# EAGLE design untitled (EAGLE 9.6.1)
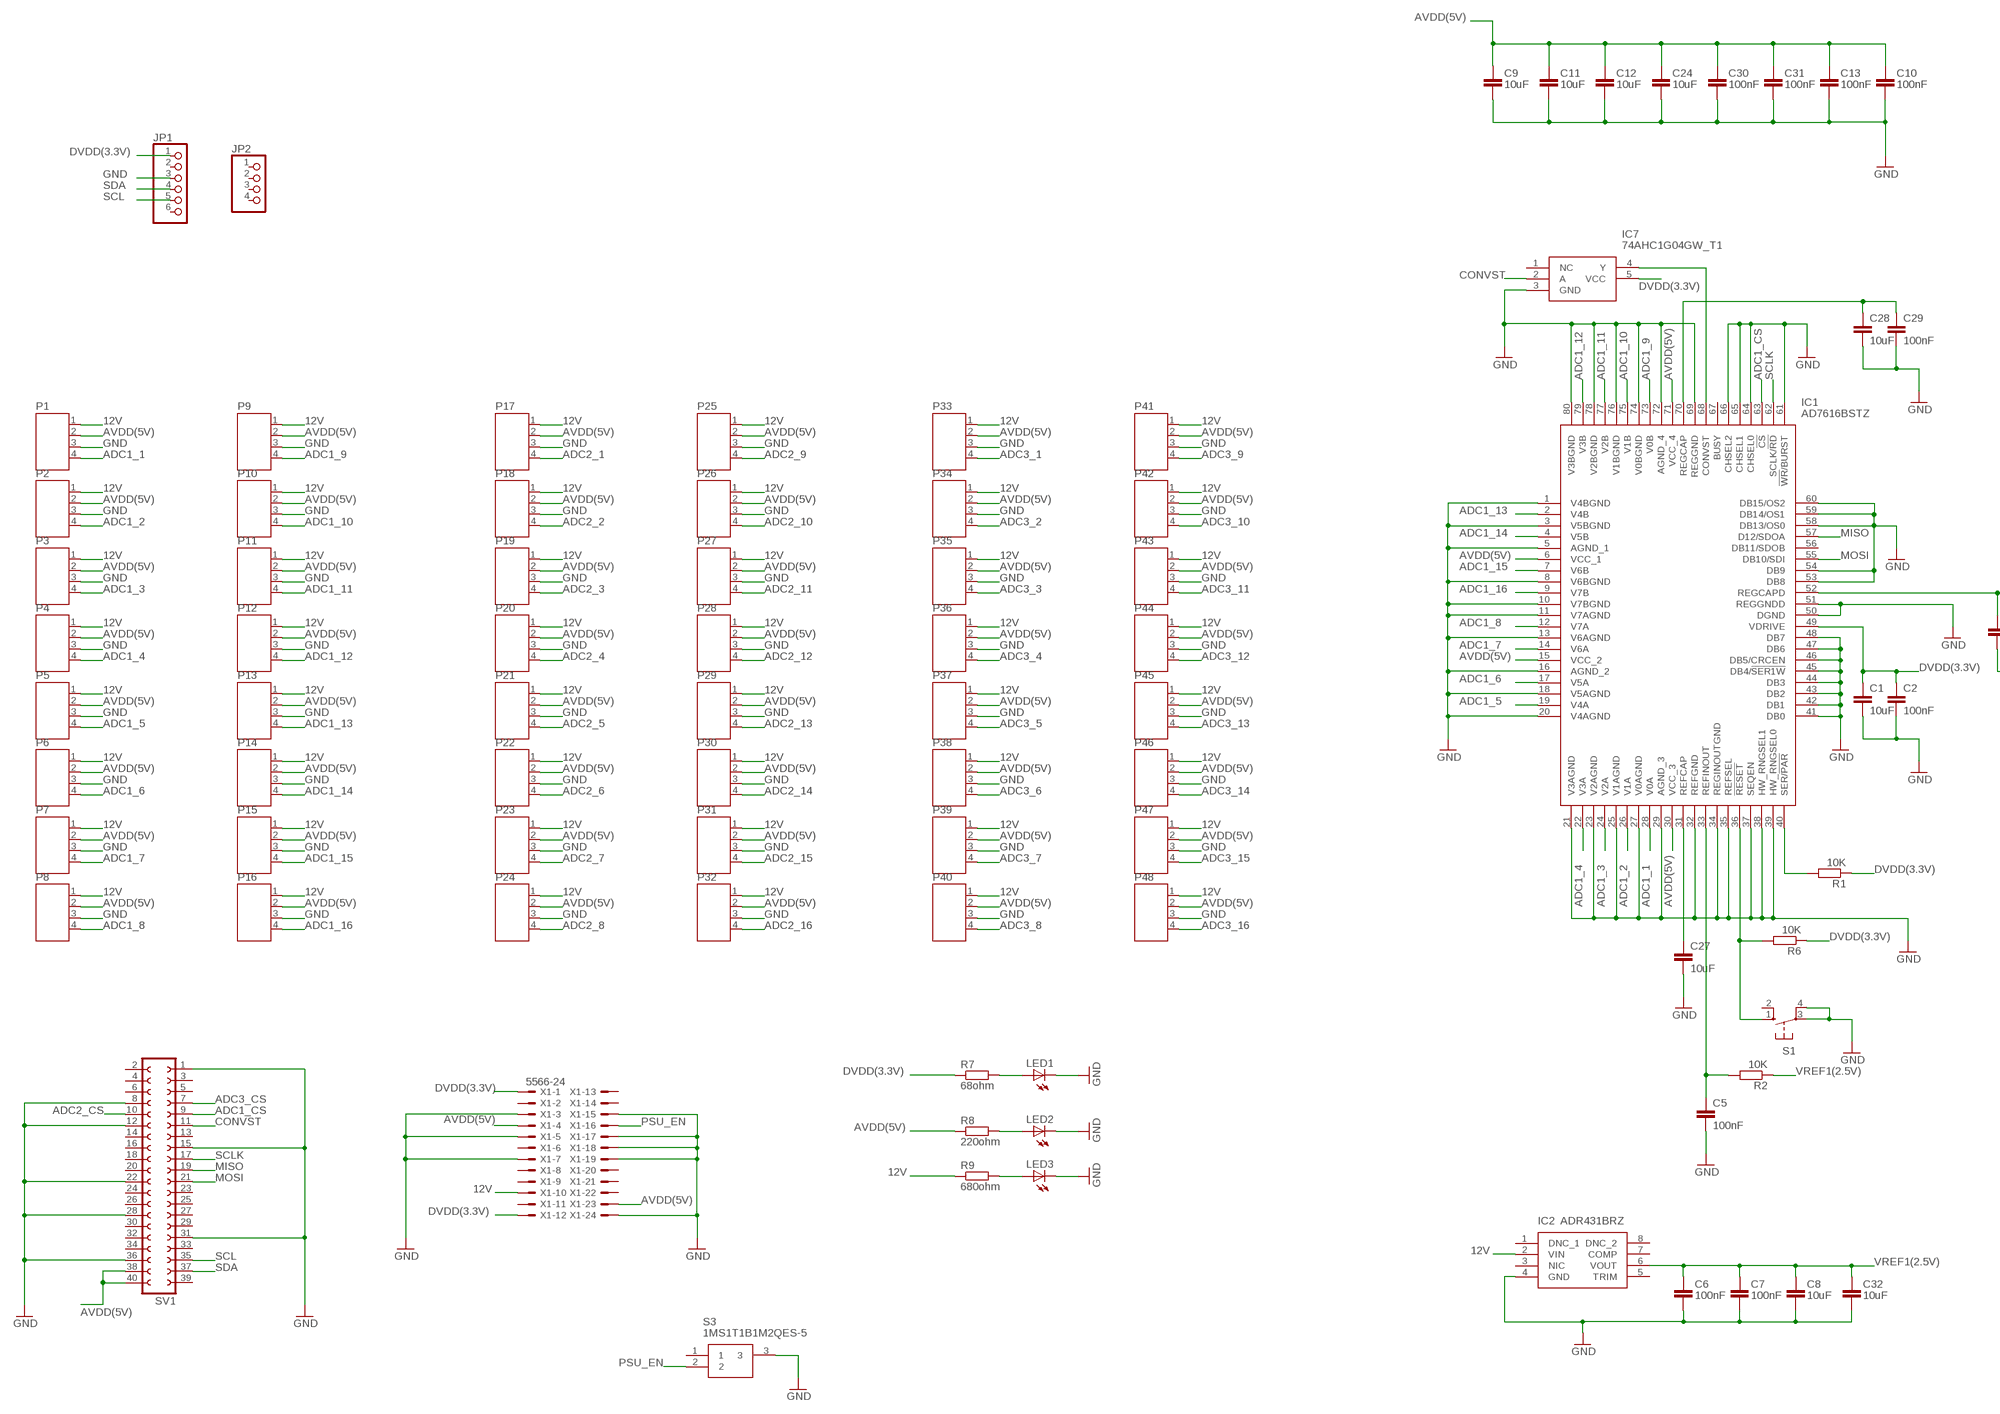
[diagram p0: schematic, sheet 1, part 1 of 2]
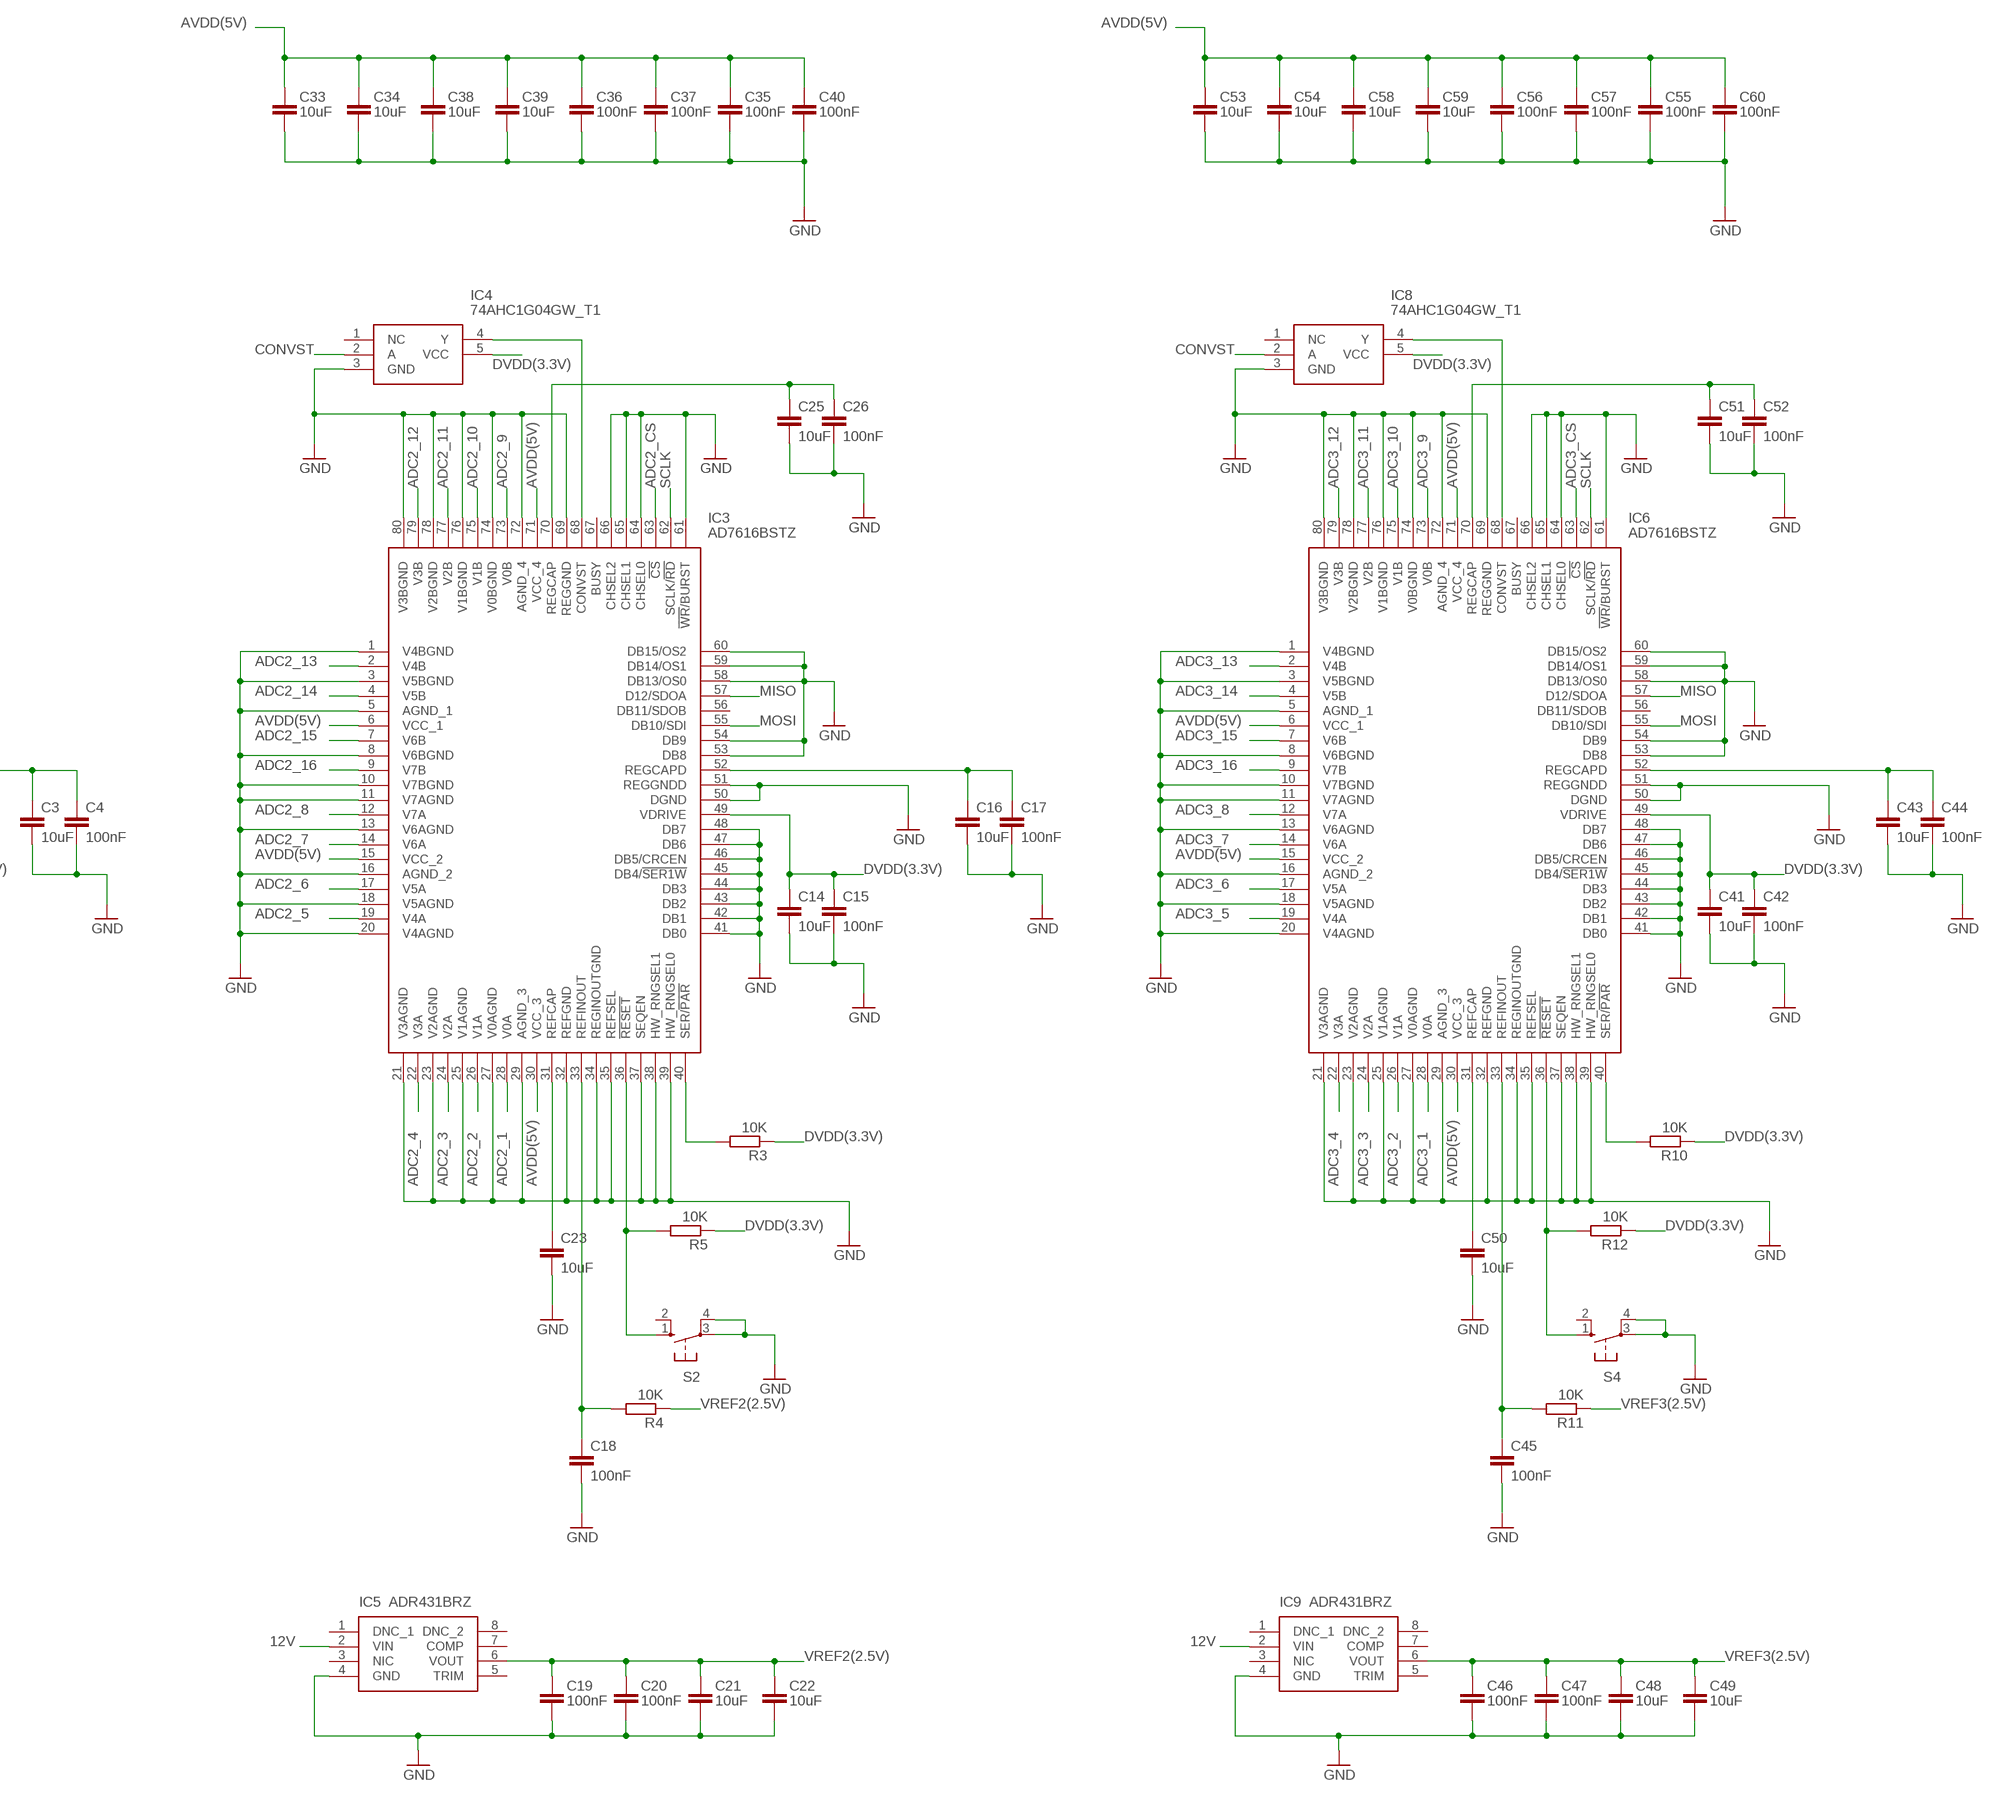
[diagram p1: schematic, sheet 1, part 2 of 2]

## Parts
C1  10uF  C-EUC1206  [C1206]
C2  100nF  C-EUC0603  [C0603]
C3  10uF  C-EUC1206  [C1206]
C4  100nF  C-EUC0603  [C0603]
C5  100nF  C-EUC0603  [C0603]
C6  100nF  C-EUC0603  [C0603]
C7  100nF  C-EUC0603  [C0603]
C8  10uF  C-EUC1206  [C1206]
C9  10uF  C-EUC1206  [C1206]
C10  100nF  C-EUC0603  [C0603]
C11  10uF  C-EUC1206  [C1206]
C12  10uF  C-EUC1206  [C1206]
C13  100nF  C-EUC0603  [C0603]
C14  10uF  C-EUC1206  [C1206]
C15  100nF  C-EUC0603  [C0603]
C16  10uF  C-EUC1206  [C1206]
C17  100nF  C-EUC0603  [C0603]
C18  100nF  C-EUC0603  [C0603]
C19  100nF  C-EUC0603  [C0603]
C20  100nF  C-EUC0603  [C0603]
C21  10uF  C-EUC1206  [C1206]
C22  10uF  C-EUC1206  [C1206]
C23  10uF  C-EUC1206  [C1206]
C24  10uF  C-EUC1206  [C1206]
C25  10uF  C-EUC1206  [C1206]
C26  100nF  C-EUC0603  [C0603]
C27  10uF  C-EUC1206  [C1206]
C28  10uF  C-EUC1206  [C1206]
C29  100nF  C-EUC0603  [C0603]
C30  100nF  C-EUC0603  [C0603]
C31  100nF  C-EUC0603  [C0603]
C32  10uF  C-EUC1206  [C1206]
C33  10uF  C-EUC1206  [C1206]
C34  10uF  C-EUC1206  [C1206]
C35  100nF  C-EUC0603  [C0603]
C36  100nF  C-EUC0603  [C0603]
C37  100nF  C-EUC0603  [C0603]
C38  10uF  C-EUC1206  [C1206]
C39  10uF  C-EUC1206  [C1206]
C40  100nF  C-EUC0603  [C0603]
C41  10uF  C-EUC1206  [C1206]
C42  100nF  C-EUC0603  [C0603]
C43  10uF  C-EUC1206  [C1206]
C44  100nF  C-EUC0603  [C0603]
C45  100nF  C-EUC0603  [C0603]
C46  100nF  C-EUC0603  [C0603]
C47  100nF  C-EUC0603  [C0603]
C48  10uF  C-EUC1206  [C1206]
C49  10uF  C-EUC1206  [C1206]
C50  10uF  C-EUC1206  [C1206]
C51  10uF  C-EUC1206  [C1206]
C52  100nF  C-EUC0603  [C0603]
C53  10uF  C-EUC1206  [C1206]
C54  10uF  C-EUC1206  [C1206]
C55  100nF  C-EUC0603  [C0603]
C56  100nF  C-EUC0603  [C0603]
C57  100nF  C-EUC0603  [C0603]
C58  10uF  C-EUC1206  [C1206]
C59  10uF  C-EUC1206  [C1206]
C60  100nF  C-EUC0603  [C0603]
IC1  AD7616BSTZ  [QFP65P1600X1600X160-80N]
IC2  ADR431BRZ  [SOIC127P600X175-8N]
IC3  AD7616BSTZ  [QFP65P1600X1600X160-80N]
IC4  74AHC1G04GW_T1  [SOT65P212X110-5N]
IC5  ADR431BRZ  [SOIC127P600X175-8N]
IC6  AD7616BSTZ  [QFP65P1600X1600X160-80N]
IC7  74AHC1G04GW_T1  [SOT65P212X110-5N]
IC8  74AHC1G04GW_T1  [SOT65P212X110-5N]
IC9  ADR431BRZ  [SOIC127P600X175-8N]
JP1  PINHD-1X6  [1X06]
JP2  PINHD-1X4  [1X04]
LED1  LEDCHIPLED_0603  [CHIPLED_0603]
LED2  LEDCHIPLED_0603  [CHIPLED_0603]
LED3  LEDCHIPLED_0603  [CHIPLED_0603]
P1  JST-PH4  [JST-PH4]
P2  JST-PH4  [JST-PH4]
P3  JST-PH4  [JST-PH4]
P4  JST-PH4  [JST-PH4]
P5  JST-PH4  [JST-PH4]
P6  JST-PH4  [JST-PH4]
P7  JST-PH4  [JST-PH4]
P8  JST-PH4  [JST-PH4]
P9  JST-PH4  [JST-PH4]
P10  JST-PH4  [JST-PH4]
P11  JST-PH4  [JST-PH4]
P12  JST-PH4  [JST-PH4]
P13  JST-PH4  [JST-PH4]
P14  JST-PH4  [JST-PH4]
P15  JST-PH4  [JST-PH4]
P16  JST-PH4  [JST-PH4]
P17  JST-PH4  [JST-PH4]
P18  JST-PH4  [JST-PH4]
P19  JST-PH4  [JST-PH4]
P20  JST-PH4  [JST-PH4]
P21  JST-PH4  [JST-PH4]
P22  JST-PH4  [JST-PH4]
P23  JST-PH4  [JST-PH4]
P24  JST-PH4  [JST-PH4]
P25  JST-PH4  [JST-PH4]
P26  JST-PH4  [JST-PH4]
P27  JST-PH4  [JST-PH4]
P28  JST-PH4  [JST-PH4]
P29  JST-PH4  [JST-PH4]
P30  JST-PH4  [JST-PH4]
P31  JST-PH4  [JST-PH4]
P32  JST-PH4  [JST-PH4]
P33  JST-PH4  [JST-PH4]
P34  JST-PH4  [JST-PH4]
P35  JST-PH4  [JST-PH4]
P36  JST-PH4  [JST-PH4]
P37  JST-PH4  [JST-PH4]
P38  JST-PH4  [JST-PH4]
P39  JST-PH4  [JST-PH4]
P40  JST-PH4  [JST-PH4]
P41  JST-PH4  [JST-PH4]
P42  JST-PH4  [JST-PH4]
P43  JST-PH4  [JST-PH4]
P44  JST-PH4  [JST-PH4]
P45  JST-PH4  [JST-PH4]
P46  JST-PH4  [JST-PH4]
P47  JST-PH4  [JST-PH4]
P48  JST-PH4  [JST-PH4]
R1  10K  R-EU_R0603  [R0603]
R2  10K  R-EU_R0603  [R0603]
R3  10K  R-EU_R0603  [R0603]
R4  10K  R-EU_R0603  [R0603]
R5  10K  R-EU_R0603  [R0603]
R6  10K  R-EU_R0603  [R0603]
R7  68ohm  R-EU_R0805  [R0805]
R8  220ohm  R-EU_R0805  [R0805]
R9  680ohm  R-EU_R0805  [R0805]
R10  10K  R-EU_R0603  [R0603]
R11  10K  R-EU_R0603  [R0603]
R12  10K  R-EU_R0603  [R0603]
S1  10-XX  [B3F-10XX]
S2  10-XX  [B3F-10XX]
S3  1MS1T1B1M2QES-5  [1MS1T1B1M2QES-5]
S4  10-XX  [B3F-10XX]
SV1  FE20-2  [FE20-2]
X1  5566-24  [5566-24]

## Nets
12V: IC2.2(VIN) IC5.2(VIN) IC9.2(VIN) P1.1 P2.1 P3.1 P4.1 P5.1 P6.1 P7.1 P8.1 P9.1 P10.1 P11.1 P12.1 P13.1 P14.1 P15.1 P16.1 P17.1 P18.1 P19.1 P20.1 P21.1 P22.1 P23.1 P24.1 P25.1 P26.1 P27.1 P28.1 P29.1 P30.1 P31.1 P32.1 P33.1 P34.1 P35.1 P36.1 P37.1 P38.1 P39.1 P40.1 P41.1 P42.1 P43.1 P44.1 P45.1 P46.1 P47.1 P48.1 R9.1 X1.10
!RESET1: IC1.36(!RESET) R6.2 S1.1(S)
!RESET2: IC3.36(!RESET) R5.2 S2.1(S)
!RESET3: IC6.36(!RESET) R12.2 S4.1(S)
ADC1_1: IC1.28(V0A) P1.4
ADC1_2: IC1.26(V1A) P2.4
ADC1_3: IC1.24(V2A) P3.4
ADC1_4: IC1.22(V3A) P4.4
ADC1_5: IC1.19(V4A) P5.4
ADC1_6: IC1.17(V5A) P6.4
ADC1_7: IC1.14(V6A) P7.4
ADC1_8: IC1.12(V7A) P8.4
ADC1_9: IC1.73(V0B) P9.4
ADC1_10: IC1.75(V1B) P10.4
ADC1_11: IC1.77(V2B) P11.4
ADC1_12: IC1.79(V3B) P12.4
ADC1_13: IC1.2(V4B) P13.4
ADC1_14: IC1.4(V5B) P14.4
ADC1_15: IC1.7(V6B) P15.4
ADC1_16: IC1.9(V7B) P16.4
ADC1_CS: IC1.63(!CS) SV1.9
ADC2_1: IC3.28(V0A) P17.4
ADC2_2: IC3.26(V1A) P18.4
ADC2_3: IC3.24(V2A) P19.4
ADC2_4: IC3.22(V3A) P20.4
ADC2_5: IC3.19(V4A) P21.4
ADC2_6: IC3.17(V5A) P22.4
ADC2_7: IC3.14(V6A) P23.4
ADC2_8: IC3.12(V7A) P24.4
ADC2_9: IC3.73(V0B) P25.4
ADC2_10: IC3.75(V1B) P26.4
ADC2_11: IC3.77(V2B) P27.4
ADC2_12: IC3.79(V3B) P28.4
ADC2_13: IC3.2(V4B) P29.4
ADC2_14: IC3.4(V5B) P30.4
ADC2_15: IC3.7(V6B) P31.4
ADC2_16: IC3.9(V7B) P32.4
ADC2_CS: IC3.63(!CS) SV1.10
ADC3_1: IC6.28(V0A) P33.4
ADC3_2: IC6.26(V1A) P34.4
ADC3_3: IC6.24(V2A) P35.4
ADC3_4: IC6.22(V3A) P36.4
ADC3_5: IC6.19(V4A) P37.4
ADC3_6: IC6.17(V5A) P38.4
ADC3_7: IC6.14(V6A) P39.4
ADC3_8: IC6.12(V7A) P40.4
ADC3_9: IC6.73(V0B) P41.4
ADC3_10: IC6.75(V1B) P42.4
ADC3_11: IC6.77(V2B) P43.4
ADC3_12: IC6.79(V3B) P44.4
ADC3_13: IC6.2(V4B) P45.4
ADC3_14: IC6.4(V5B) P46.4
ADC3_15: IC6.7(V6B) P47.4
ADC3_16: IC6.9(V7B) P48.4
ADC3_CS: IC6.63(!CS) SV1.7
AVDD(5V): C9.1 C10.1 C11.1 C12.1 C13.1 C24.1 C30.1 C31.1 C33.1 C34.1 C35.1 C36.1 C37.1 C38.1 C39.1 C40.1 C53.1 C54.1 C55.1 C56.1 C57.1 C58.1 C59.1 C60.1 IC1.6(VCC_1) IC1.15(VCC_2) IC1.30(VCC_3) IC1.71(VCC_4) IC3.6(VCC_1) IC3.15(VCC_2) IC3.30(VCC_3) IC3.71(VCC_4) IC6.6(VCC_1) IC6.15(VCC_2) IC6.30(VCC_3) IC6.71(VCC_4) P1.2 P2.2 P3.2 P4.2 P5.2 P6.2 P7.2 P8.2 P9.2 P10.2 P11.2 P12.2 P13.2 P14.2 P15.2 P16.2 P17.2 P18.2 P19.2 P20.2 P21.2 P22.2 P23.2 P24.2 P25.2 P26.2 P27.2 P28.2 P29.2 P30.2 P31.2 P32.2 P33.2 P34.2 P35.2 P36.2 P37.2 P38.2 P39.2 P40.2 P41.2 P42.2 P43.2 P44.2 P45.2 P46.2 P47.2 P48.2 R8.1 SV1.38 SV1.40 X1.4 X1.23
CONVST: IC4.2(A) IC7.2(A) IC8.2(A) SV1.11
CONVST1: IC1.68(CONVST) IC7.4(Y)
CONVST2: IC3.68(CONVST) IC4.4(Y)
CONVST3: IC6.68(CONVST) IC8.4(Y)
DVDD(3.3V): C1.1 C2.1 C14.1 C15.1 C41.1 C42.1 IC1.49(VDRIVE) IC3.49(VDRIVE) IC4.5(VCC) IC6.49(VDRIVE) IC7.5(VCC) IC8.5(VCC) JP1.1 R1.1 R3.1 R5.1 R6.1 R7.1 R10.1 R12.1 X1.1 X1.12
GND: C1.2 C2.2 C3.2 C4.2 C5.2 C6.2 C7.2 C8.2 C9.2 C10.2 C11.2 C12.2 C13.2 C14.2 C15.2 C16.2 C17.2 C18.2 C19.2 C20.2 C21.2 C22.2 C23.2 C24.2 C25.2 C26.2 C27.2 C28.2 C29.2 C30.2 C31.2 C32.2 C33.2 C34.2 C35.2 C36.2 C37.2 C38.2 C39.2 C40.2 C41.2 C42.2 C43.2 C44.2 C45.2 C46.2 C47.2 C48.2 C49.2 C50.2 C51.2 C52.2 C53.2 C54.2 C55.2 C56.2 C57.2 C58.2 C59.2 C60.2 IC1.1(V4BGND) IC1.3(V5BGND) IC1.5(AGND_1) IC1.8(V6BGND) IC1.10(V7BGND) IC1.11(V7AGND) IC1.13(V6AGND) IC1.16(AGND_2) IC1.18(V5AGND) IC1.20(V4AGND) IC1.21(V3AGND) IC1.23(V2AGND) IC1.25(V1AGND) IC1.27(V0AGND) IC1.29(AGND_3) IC1.32(REFGND) IC1.34(REGINOUTGND) IC1.35(REFSEL) IC1.37(SEQEN) IC1.38(HW_RNGSEL1) IC1.39(HW_RNGSEL0) IC1.41(DB0) IC1.42(DB1) IC1.43(DB2) IC1.44(DB3) IC1.45(DB4/!SER1W) IC1.46(DB5/CRCEN) IC1.47(DB6) IC1.48(DB7) IC1.50(DGND) IC1.51(REGGNDD) IC1.53(DB8) IC1.54(DB9) IC1.58(DB13/OS0) IC1.59(DB14/OS1) IC1.60(DB15/OS2) IC1.61(!WR!/BURST) IC1.64(CHSEL0) IC1.65(CHSEL1) IC1.66(CHSEL2) IC1.69(REGGND) IC1.72(AGND_4) IC1.74(V0BGND) IC1.76(V1BGND) IC1.78(V2BGND) IC1.80(V3BGND) IC2.4(GND) IC3.1(V4BGND) IC3.3(V5BGND) IC3.5(AGND_1) IC3.8(V6BGND) IC3.10(V7BGND) IC3.11(V7AGND) IC3.13(V6AGND) IC3.16(AGND_2) IC3.18(V5AGND) IC3.20(V4AGND) IC3.21(V3AGND) IC3.23(V2AGND) IC3.25(V1AGND) IC3.27(V0AGND) IC3.29(AGND_3) IC3.32(REFGND) IC3.34(REGINOUTGND) IC3.35(REFSEL) IC3.37(SEQEN) IC3.38(HW_RNGSEL1) IC3.39(HW_RNGSEL0) IC3.41(DB0) IC3.42(DB1) IC3.43(DB2) IC3.44(DB3) IC3.45(DB4/!SER1W) IC3.46(DB5/CRCEN) IC3.47(DB6) IC3.48(DB7) IC3.50(DGND) IC3.51(REGGNDD) IC3.53(DB8) IC3.54(DB9) IC3.58(DB13/OS0) IC3.59(DB14/OS1) IC3.60(DB15/OS2) IC3.61(!WR!/BURST) IC3.64(CHSEL0) IC3.65(CHSEL1) IC3.66(CHSEL2) IC3.69(REGGND) IC3.72(AGND_4) IC3.74(V0BGND) IC3.76(V1BGND) IC3.78(V2BGND) IC3.80(V3BGND) IC4.3(GND) IC5.4(GND) IC6.1(V4BGND) IC6.3(V5BGND) IC6.5(AGND_1) IC6.8(V6BGND) IC6.10(V7BGND) IC6.11(V7AGND) IC6.13(V6AGND) IC6.16(AGND_2) IC6.18(V5AGND) IC6.20(V4AGND) IC6.21(V3AGND) IC6.23(V2AGND) IC6.25(V1AGND) IC6.27(V0AGND) IC6.29(AGND_3) IC6.32(REFGND) IC6.34(REGINOUTGND) IC6.35(REFSEL) IC6.37(SEQEN) IC6.38(HW_RNGSEL1) IC6.39(HW_RNGSEL0) IC6.41(DB0) IC6.42(DB1) IC6.43(DB2) IC6.44(DB3) IC6.45(DB4/!SER1W) IC6.46(DB5/CRCEN) IC6.47(DB6) IC6.48(DB7) IC6.50(DGND) IC6.51(REGGNDD) IC6.53(DB8) IC6.54(DB9) IC6.58(DB13/OS0) IC6.59(DB14/OS1) IC6.60(DB15/OS2) IC6.61(!WR!/BURST) IC6.64(CHSEL0) IC6.65(CHSEL1) IC6.66(CHSEL2) IC6.69(REGGND) IC6.72(AGND_4) IC6.74(V0BGND) IC6.76(V1BGND) IC6.78(V2BGND) IC6.80(V3BGND) IC7.3(GND) IC8.3(GND) IC9.4(GND) JP1.3 LED1.C LED2.C LED3.C P1.3 P2.3 P3.3 P4.3 P5.3 P6.3 P7.3 P8.3 P9.3 P10.3 P11.3 P12.3 P13.3 P14.3 P15.3 P16.3 P17.3 P18.3 P19.3 P20.3 P21.3 P22.3 P23.3 P24.3 P25.3 P26.3 P27.3 P28.3 P29.3 P30.3 P31.3 P32.3 P33.3 P34.3 P35.3 P36.3 P37.3 P38.3 P39.3 P40.3 P41.3 P42.3 P43.3 P44.3 P45.3 P46.3 P47.3 P48.3 S1.3(P) S1.4(P1) S2.3(P) S2.4(P1) S3.3 S4.3(P) S4.4(P1) SV1.1 SV1.8 SV1.12 SV1.15 SV1.22 SV1.28 SV1.31 SV1.36 X1.3 X1.5 X1.7 X1.15 X1.17 X1.18 X1.19 X1.24
MISO: IC1.57(D12/SDOA) IC3.57(D12/SDOA) IC6.57(D12/SDOA) SV1.19
MOSI: IC1.55(DB10/SDI) IC3.55(DB10/SDI) IC6.55(DB10/SDI) SV1.21
N$1: LED2.A R8.2
N$3: LED1.A R7.2
N$4: LED3.A R9.2
PSU_EN: S3.2 X1.16
REFCAP1: C27.1 IC1.31(REFCAP)
REFCAP2: C23.1 IC3.31(REFCAP)
REFCAP3: C50.1 IC6.31(REFCAP)
REFINOUT1: C5.1 IC1.33(REFINOUT) R2.2
REFINOUT2: C18.1 IC3.33(REFINOUT) R4.2
REFINOUT3: C45.1 IC6.33(REFINOUT) R11.2
REGCAP1: C28.1 C29.1 IC1.70(REGCAP)
REGCAP2: C25.1 C26.1 IC3.70(REGCAP)
REGCAP3: C51.1 C52.1 IC6.70(REGCAP)
REGCAPD1: C3.1 C4.1 IC1.52(REGCAPD)
REGCAPD2: C16.1 C17.1 IC3.52(REGCAPD)
REGCAPD3: C43.1 C44.1 IC6.52(REGCAPD)
SCL: JP1.5 SV1.35
SCLK: IC1.62(SCLK/!RD) IC3.62(SCLK/!RD) IC6.62(SCLK/!RD) SV1.17
SDA: JP1.4 SV1.37
SER/!PAR1: IC1.40(SER/!PAR) R1.2
SER/!PAR2: IC3.40(SER/!PAR) R3.2
SER/!PAR3: IC6.40(SER/!PAR) R10.2
VREF1(2.5V): C6.1 C7.1 C8.1 C32.1 IC2.6(VOUT) R2.1
VREF2(2.5V): C19.1 C20.1 C21.1 C22.1 IC5.6(VOUT) R4.1
VREF3(2.5V): C46.1 C47.1 C48.1 C49.1 IC9.6(VOUT) R11.1
Unconnected: IC1.56(DB11/SDOB) IC1.67(BUSY) IC2.1(DNC_1) IC2.3(NIC) IC2.5(TRIM) IC2.7(COMP) IC2.8(DNC_2) IC3.56(DB11/SDOB) IC3.67(BUSY) IC4.1(NC) IC5.1(DNC_1) IC5.3(NIC) IC5.5(TRIM) IC5.7(COMP) IC5.8(DNC_2) IC6.56(DB11/SDOB) IC6.67(BUSY) IC7.1(NC) IC8.1(NC) IC9.1(DNC_1) IC9.3(NIC) IC9.5(TRIM) IC9.7(COMP) IC9.8(DNC_2) JP1.2 JP1.6 JP2.1 JP2.2 JP2.3 JP2.4 S1.2(S1) S2.2(S1) S3.1 S4.2(S1) SV1.2 SV1.3 SV1.4 SV1.5 SV1.6 SV1.13 SV1.14 SV1.16 SV1.18 SV1.20 SV1.23 SV1.24 SV1.25 SV1.26 SV1.27 SV1.29 SV1.30 SV1.32 SV1.33 SV1.34 SV1.39 X1.2 X1.6 X1.8 X1.9 X1.11 X1.13 X1.14 X1.20 X1.21 X1.22

## Library data of the parts
C1-C60 = rcl:C-EU: CAPACITOR, European symbol; SPICEPREFIX: C
IC1 IC3 IC6 = AD7616BSTZ:AD7616BSTZ: Data Acquisition ADCs/DACs - Specialized 100ksps 16 ch muxed Dual 16B SAR ADC Source: Datasheet <https://componentsearchengine.com/Datasheets/1/AD7616BSTZ.pdf>; DESCRIPTION: Data Acquisition ADCs/DACs - Specialized 100ksps 16 ch muxed Dual 16B SAR ADC; HEIGHT: 1.6mm; MANUFACTURER_NAME: Analog Devices; MANUFACTURER_PART_NUMBER: AD7616BSTZ; MOUSER_PART_NUMBER: 584-AD7616BSTZ; MOUSER_PRICE-STOCK: https://www.mouser.com/Search/Refine.aspx?Keyword=584-AD7616BSTZ; RS_PART_NUMBER: 1311218P; RS_PRICE-STOCK: http://uk.rs-online.com/web/p/products/1311218P
IC2 IC5 IC9 = ADR431BRZ:ADR431BRZ: ADR431BRZ, Precision Voltage Reference 2.499 to 2.501V, 0.04% 30mA 20V max. 8-Pin SOIC Source: Datasheet <http://www.analog.com/static/imported-files/data_sheets/ADR430_431_433_434_435.pdf>; DESCRIPTION: ADR431BRZ, Precision Voltage Reference 2.499 to 2.501V, 0.04% 30mA 20V max. 8-Pin SOIC; HEIGHT: 1.75mm; MANUFACTURER_NAME: Analog Devices; MANUFACTURER_PART_NUMBER: ADR431BRZ; MOUSER_PART_NUMBER: 584-ADR431BRZ; MOUSER_PRICE-STOCK: https://www.mouser.com/Search/Refine.aspx?Keyword=584-ADR431BRZ; RS_PART_NUMBER: 6977745P; RS_PRICE-STOCK: http://uk.rs-online.com/web/p/products/6977745P
IC4 IC7 IC8 = 74AHC1G04GW_T1:74AHC1G04GW_T1: NXP - 74AHC1G04GW - INVERTER, 74AHC SINGLE GATE, SOT-353 Source: Datasheet <http://www.nxp.com/documents/data_sheet/74AHC_AHCT1G04.pdf>; DESCRIPTION: NXP - 74AHC1G04GW - INVERTER, 74AHC SINGLE GATE, SOT-353; HEIGHT: 1.1mm; MANUFACTURER_NAME: Nexperia; MANUFACTURER_PART_NUMBER: 74AHC1G04GW/T1
JP1 = pinhead:PINHD-1X6: PIN HEADER
JP2 = pinhead:PINHD-1X4: PIN HEADER
LED1-LED3 = adafruit:LED: LED OSRAM: - CHIPLED LG R971, LG N971, LY N971, LG Q971, LY Q971, LO R971, LY R971 LH N974, LH R974 LS Q976, LO Q976, LY Q976 LO Q996 - Hyper CHIPLED LW Q18S LB Q993, LB Q99A, LB R99A - SideLED LS A670, LO A670, LY A670, LG A670, LP A670 LB A673, LV A673, LT A673, LW A673 LH A674 LY A675 LS A676, LA A676, LO A676, LY A676, LW A676 LS A679, LY A679, LG A679 - Hyper Micro SIDELED® LS Y876, LA Y876, LO Y876, LY Y876 LT Y87S - SmartLED LW L88C, LW L88S LB L89C, LB L89S, LG L890 LS L89K, LO L89K, LY L89K LS L896, LA L896, LO L896, LY L896 - TOPLED LS T670, LO T670, LY T670, LG T670, LP T670 LSG T670, LSP T670, LSY T670, LOP T670, LYG T670 LG T671, LOG T671, LSG T671 LB T673, LV T673, LT T673, LW T673 LH T674 LS T676, LA T676, LO T676, LY T676, LB T676, LH T676, LSB T676, LW T676 LB T67C, LV T67C, LT T67C, LS T67K, LO T67K, LY T67K, LW E67C LS E67B, LA E67B, LO E67B, LY E67B, LB E67C, LV E67C, LT E67C LW T67C LS T679, LY T679, LG T679 LS T770, LO T770, LY T770, LG T770, LP T770 LB T773, LV T773, LT T773, LW T773 LH T774 LS E675, LA E675, LY E675, LS T675 LS T776, LA T776, LO T776, LY T776, LB T776 LHGB T686 LT T68C, LB T68C - Hyper Mini TOPLED® LB M676 - Mini TOPLED Santana® LG M470 LS M47K, LO M47K, LY M47K Source: http://www.osram.convergy.de/
P1-P48 = jst-ph:JST-PH4
R1-R12 = rcl:R-EU_: RESISTOR, European symbol; SPICEPREFIX: R
S1 S2 S4 = switch-omron:10-XX: OMRON SWITCH; MPN: B3F-1000; OC_FARNELL: 176432; OC_NEWARK: 36M3542
S3 = 1MS1T1B1M2QES-5:1MS1T1B1M2QES-5: Toggle switch,SP,on-none-on,PC thru-hole Toggle Switch SPDT On-On, 5 A @ 250 V ac, PCB Source: Datasheet <http://uk.rs-online.com/web/p/products/7347066>; DESCRIPTION: Toggle switch,SP,on-none-on,PC thru-hole Toggle Switch SPDT On-On, 5 A @ 250 V ac, PCB; HEIGHT: mm; MANUFACTURER_NAME: RS Components; MANUFACTURER_PART_NUMBER: 1MS1T1B1M2QES-5; RS_PART_NUMBER: 7347066; RS_PRICE-STOCK: https://uk.rs-online.com/web/p/products/7347066
SV1 = con-lsta:FE20-2: FEMALE HEADER; OC_FARNELL: unknown; OC_NEWARK: unknown
X1 = con-molex:5566-24: Mini FIT connector 24 pol Source: http://www.molex.com; MF: MOLEX; OC_FARNELL: unknown; OC_NEWARK: unknown

## Net classes
0 default: width 0.254 mm, clearance 0.178 mm

## Board
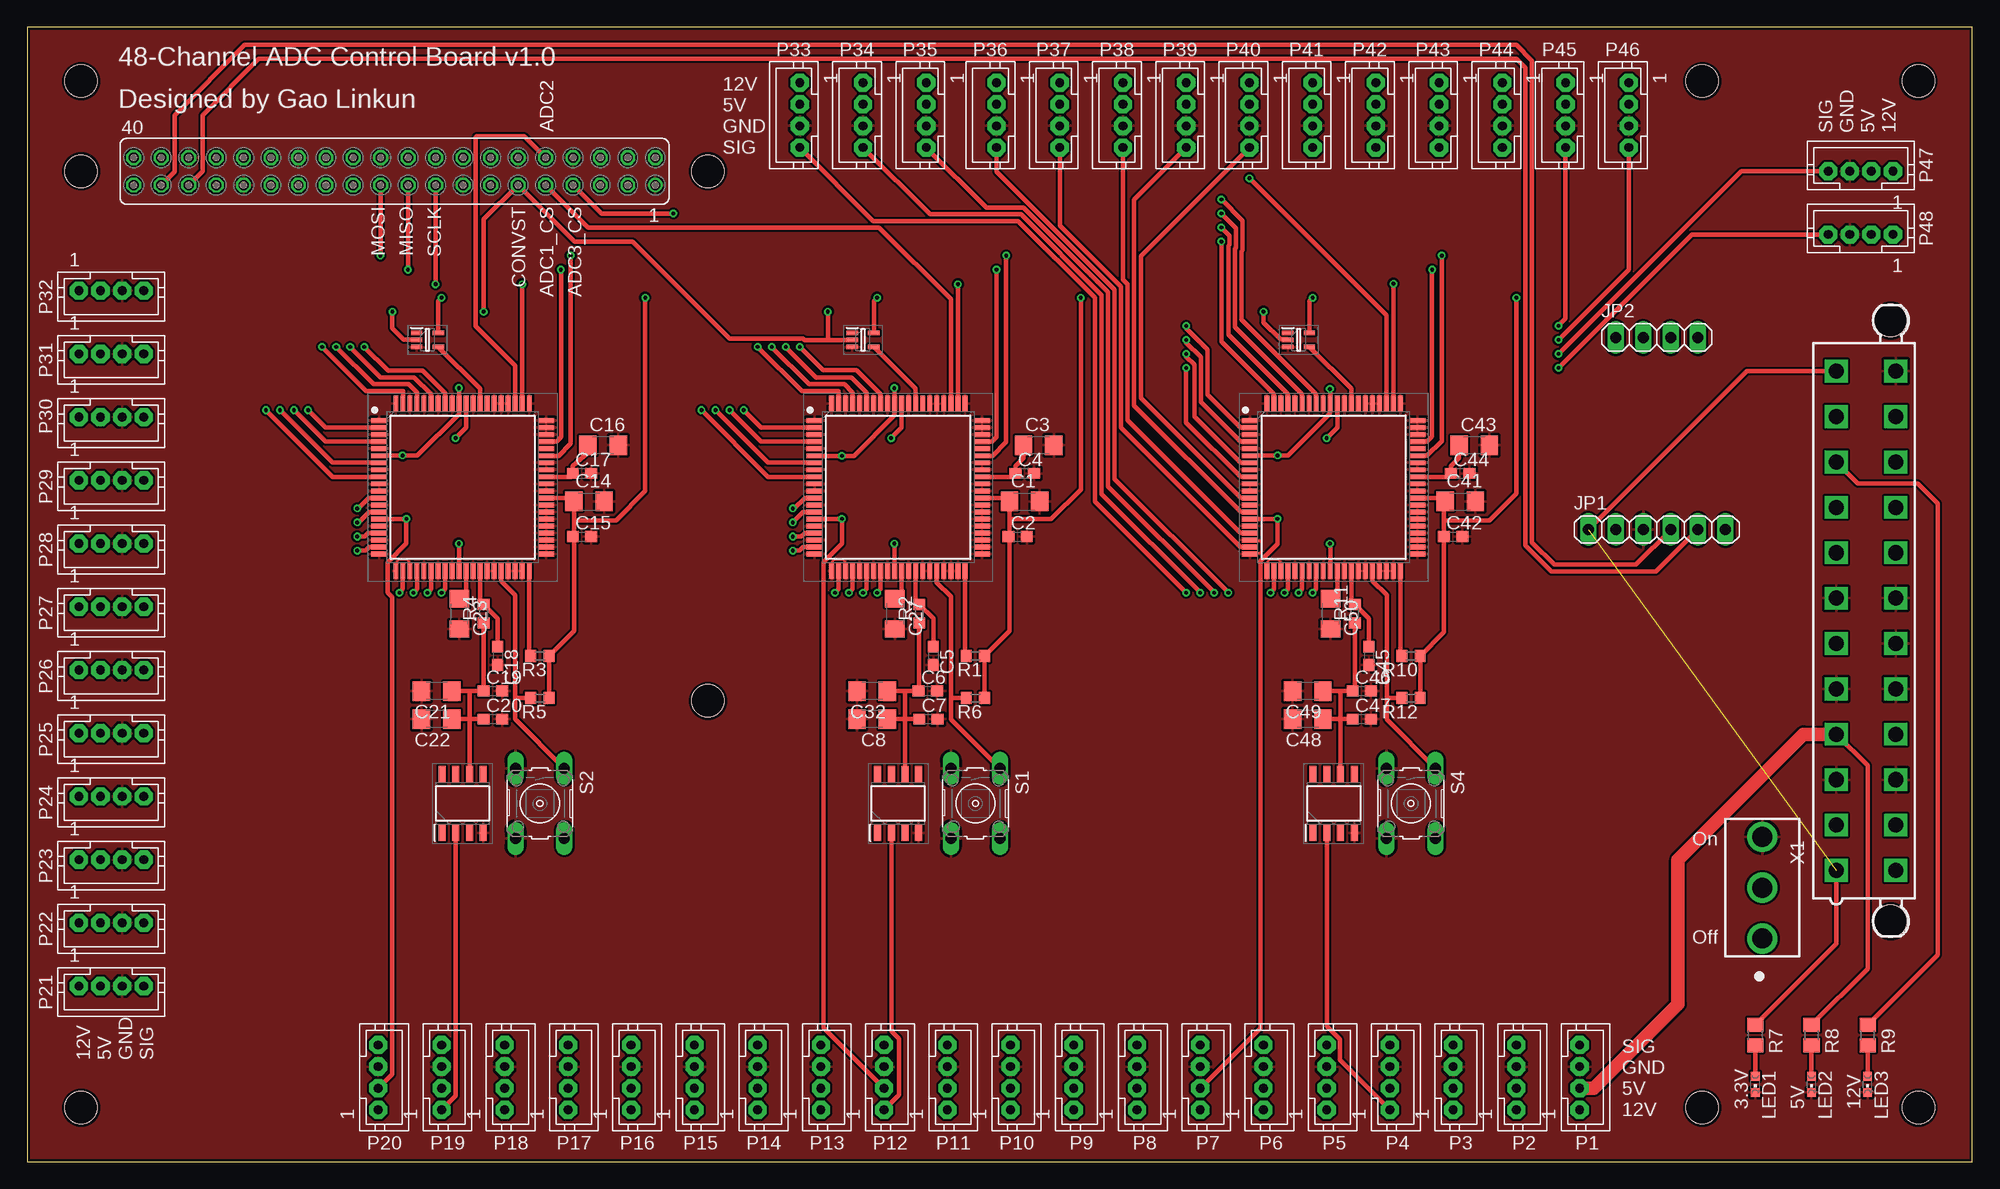
[diagram p2: board, top side]
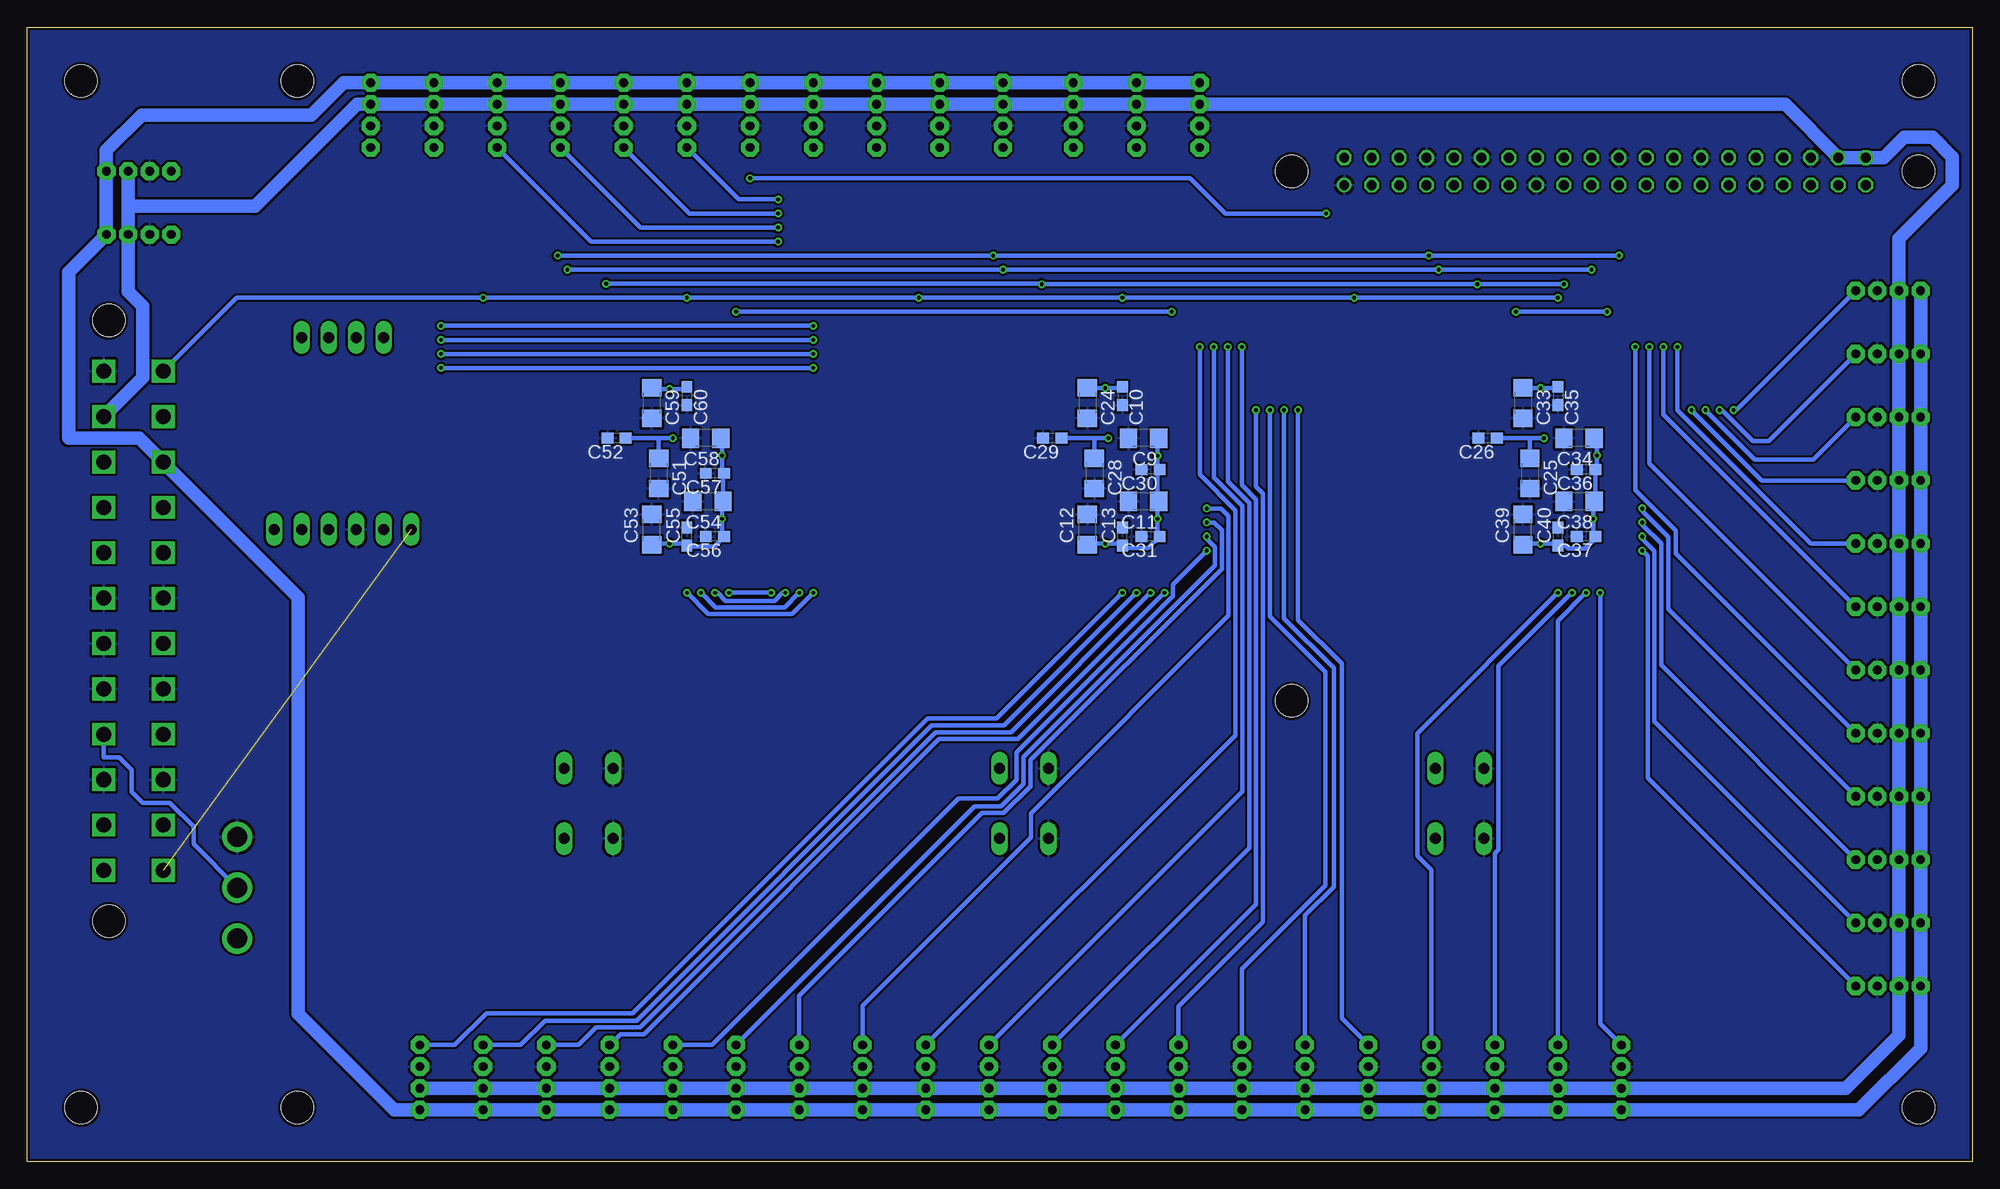
[diagram p3: board, bottom side, seen from below]

Size 180 x 105 mm. Coordinates in mm from the lower left corner, seen from the top.
Outline: 0,0 180,0 180,105 0,105 0,0
Copper layers (1+2*15+16): Top 0.035mm / dielectric 1.5mm / Route2 0.0175mm / dielectric 1.1mm / Route15 0.0175mm / dielectric 0.2mm / Bottom 0.035mm
Design rules "dirt_cheap_dirty_boards.v1.1": minimum track width 6mil, minimum drill 12mil, track to track 0.2mm, track to pad 0.2mm, pad to pad 0.2mm, via to via 0.2mm, smd to smd 0mil, copper to edge 10mil, drill to drill 10mil, minimum pad ring 7mil, minimum via ring 0.175mm, stop-mask expansion 2mil, vias tented up to drill 25mil, thermal gap 10mil
Holes 3 mm at 5,100 5,91.65 63,91.65 175,100 5,5 175,5 155,100 155,5 63,42.65

### Footprints (pad centres in the part's own frame; a part is rotated, then mirrored left to right if it is on the bottom)
C1206 = smd 1.6 x 1.8: 1 -1.4,0; 2 1.4,0
C0603 = smd 1.1 x 1: 1 -0.85,0; 2 0.85,0
QFP65P1600X1600X160-80N = smd 1.475 x 0.45: 1 -7.738,6.175; 2 -7.738,5.525; 3 -7.738,4.875; 4 -7.738,4.225; 5 -7.738,3.575; 6 -7.738,2.925; 7 -7.738,2.275; 8 -7.738,1.625; 9 -7.738,0.975; 10 -7.738,0.325; 11 -7.738,-0.325; 12 -7.738,-0.975; 13 -7.738,-1.625; 14 -7.738,-2.275; 15 -7.738,-2.925; 16 -7.738,-3.575; 17 -7.738,-4.225; 18 -7.738,-4.875; 19 -7.738,-5.525; 20 -7.738,-6.175; 41 7.738,-6.175; 42 7.738,-5.525; 43 7.738,-4.875; 44 7.738,-4.225; 45 7.738,-3.575; 46 7.738,-2.925; 47 7.738,-2.275; 48 7.738,-1.625; 49 7.738,-0.975; 50 7.738,-0.325; 51 7.738,0.325; 52 7.738,0.975; 53 7.738,1.625; 54 7.738,2.275; 55 7.738,2.925; 56 7.738,3.575; 57 7.738,4.225; 58 7.738,4.875; 59 7.738,5.525; 60 7.738,6.175 | smd 0.45 x 1.475: 21 -6.175,-7.738; 22 -5.525,-7.738; 23 -4.875,-7.738; 24 -4.225,-7.738; 25 -3.575,-7.738; 26 -2.925,-7.738; 27 -2.275,-7.738; 28 -1.625,-7.738; 29 -0.975,-7.738; 30 -0.325,-7.738; 31 0.325,-7.738; 32 0.975,-7.738; 33 1.625,-7.738; 34 2.275,-7.738; 35 2.925,-7.738; 36 3.575,-7.738; 37 4.225,-7.738; 38 4.875,-7.738; 39 5.525,-7.738; 40 6.175,-7.738; 61 6.175,7.738; 62 5.525,7.738; 63 4.875,7.738; 64 4.225,7.738; 65 3.575,7.738; 66 2.925,7.738; 67 2.275,7.738; 68 1.625,7.738; 69 0.975,7.738; 70 0.325,7.738; 71 -0.325,7.738; 72 -0.975,7.738; 73 -1.625,7.738; 74 -2.275,7.738; 75 -2.925,7.738; 76 -3.575,7.738; 77 -4.225,7.738; 78 -4.875,7.738; 79 -5.525,7.738; 80 -6.175,7.738
SOIC127P600X175-8N = smd 1.525 x 0.65: 1 -2.712,1.905; 2 -2.712,0.635; 3 -2.712,-0.635; 4 -2.712,-1.905; 5 2.712,-1.905; 6 2.712,-0.635; 7 2.712,0.635; 8 2.712,1.905
SOT65P212X110-5N = smd 1.05 x 0.4: 1 -1,0.65; 2 -1,0; 3 -1,-0.65; 4 1,-0.65; 5 1,0.65
1X06 = drill 1.016 long: 1 -6.35,0; 2 -3.81,0; 3 -1.27,0; 4 1.27,0; 5 3.81,0; 6 6.35,0
1X04 = drill 1.016 long: 1 -3.81,0; 2 -1.27,0; 3 1.27,0; 4 3.81,0
CHIPLED_0603 = smd 0.8 x 0.8: A 0,-0.75; C 0,0.75
JST-PH4 = drill 0.813 pad 1.676 octagon: 1 3,0; 2 1,0; 3 -1,0; 4 -3,0
R0603 = smd 1 x 1.1: 1 -0.85,0; 2 0.85,0
R0805 = smd 1.3 x 1.5: 1 -0.95,0; 2 0.95,0
B3F-10XX = drill 1.016 long: 1 -3.251,2.261; 2 3.251,2.261; 3 -3.251,-2.261; 4 3.251,-2.261
1MS1T1B1M2QES-5 = drill 1.85 pad 2.8: 1 0,-4.7; 2 0,0; 3 0,4.7
FE20-2 = drill 0.914: 1 -24.13,1.27 | drill 0.914 octagon: 2 -24.13,-1.27; 3 -21.59,1.27; 4 -21.59,-1.27; 5 -19.05,1.27; 6 -19.05,-1.27; 7 -16.51,1.27; 8 -16.51,-1.27; 9 -13.97,1.27; 10 -13.97,-1.27; 11 -11.43,1.27; 12 -11.43,-1.27; 13 -8.89,1.27; 14 -8.89,-1.27; 15 -6.35,1.27; 16 -6.35,-1.27; 17 -3.81,1.27; 18 -3.81,-1.27; 19 -1.27,1.27; 20 -1.27,-1.27; 21 1.27,1.27; 22 1.27,-1.27; 23 3.81,1.27; 24 3.81,-1.27; 25 6.35,1.27; 26 6.35,-1.27; 27 8.89,1.27; 28 8.89,-1.27; 29 11.43,1.27; 30 11.43,-1.27; 31 13.97,1.27; 32 13.97,-1.27; 33 16.51,1.27; 34 16.51,-1.27; 35 19.05,1.27; 36 19.05,-1.27; 37 21.59,1.27; 38 21.59,-1.27; 39 24.13,1.27; 40 24.13,-1.27
5566-24 = drill 1.4 square: 1 23.1,-2.75; 2 18.9,-2.75; 3 14.7,-2.75; 4 10.5,-2.75; 5 6.3,-2.75; 6 2.1,-2.75; 7 -2.1,-2.75; 8 -6.3,-2.75; 9 -10.5,-2.75; 10 -14.7,-2.75; 11 -18.9,-2.75; 12 -23.1,-2.75; 13 23.1,2.75; 14 18.9,2.75; 15 14.7,2.75; 16 10.5,2.75; 17 6.3,2.75; 18 2.1,2.75; 19 -2.1,2.75; 20 -6.3,2.75; 21 -10.5,2.75; 22 -14.7,2.75; 23 -18.9,2.75; 24 -23.1,2.75 | hole 3: 27.8,2.29; -27.8,2.29

### Placement (x,y rotation side)
C1  92.3,61.1 0 top
C2  91.65,57.85 0 top
C3  93.6,66.3 0 top
C4  92.3,63.7 0 top
C5  83.85,46.8 270 top
C6  83.35,43.55 0 top
C7  83.4,40.95 0 top
C8  78.2,40.95 180 top
C9  76.7,66.95 180 bottom
C10  78.65,70.85 270 bottom
C11  76.7,61.1 180 bottom
C12  81.9,58.5 90 bottom
C13  78.65,57.85 90 bottom
C14  52,61.1 0 top
C15  51.35,57.85 0 top
C16  53.3,66.3 0 top
C17  51.35,63.7 0 top
C18  43.55,46.8 270 top
C19  43.1,43.55 0 top
C20  43.1,40.95 0 top
C21  37.9,43.55 180 top
C22  37.9,40.95 180 top
C23  40,50.7 270 top
C24  81.9,70.2 270 bottom
C25  40.95,63.7 270 bottom
C26  44.85,66.95 180 bottom
C27  80.3,50.7 270 top
C28  81.25,63.7 270 bottom
C29  85.15,66.95 180 bottom
C30  76.05,64.05 180 bottom
C31  76.05,57.85 180 bottom
C32  78.2,43.55 180 top
C33  41.6,70.2 270 bottom
C34  36.4,66.95 180 bottom
C35  38.35,70.85 270 bottom
C36  35.75,64.05 180 bottom
C37  35.75,57.85 180 bottom
C38  36.4,61.1 180 bottom
C39  41.6,58.5 90 bottom
C40  38.35,57.85 90 bottom
C41  132.6,61.1 0 top
C42  131.95,57.85 0 top
C43  133.9,66.3 0 top
C44  132.6,63.7 0 top
C45  124.15,46.8 270 top
C46  123.5,43.55 0 top
C47  123.5,40.95 0 top
C48  118.5,40.95 180 top
C49  118.5,43.55 180 top
C50  120.6,50.7 270 top
C51  121.55,63.7 270 bottom
C52  125.45,66.95 180 bottom
C53  122.2,58.5 90 bottom
C54  117,61.1 180 bottom
C55  118.95,57.85 90 bottom
C56  116.35,57.85 180 bottom
C57  116.35,63.7 180 bottom
C58  117.2,66.95 180 bottom
C59  122.2,70.2 270 bottom
C60  118.95,70.85 270 bottom
IC1  80.6,62.4 0 top
IC2  80.6,33.15 90 top
IC3  40.3,62.4 0 top
IC4  37.05,76.05 0 top
IC5  40.3,33.15 90 top
IC6  120.9,62.4 0 top
IC7  77.35,76.05 0 top
IC8  117.65,76.05 0 top
IC9  120.9,33.15 90 top
JP1  150.8,58.5 0 top
JP2  150.8,76.28 0 top
LED1  159.9,7.15 180 top
LED2  165.1,7.15 180 top
LED3  170.3,7.15 180 top
P1  143.65,7.8 270 top
P2  137.8,7.8 270 top
P3  131.95,7.8 270 top
P4  126.1,7.8 270 top
P5  120.25,7.8 270 top
P6  114.4,7.8 270 top
P7  108.55,7.8 270 top
P8  102.7,7.8 270 top
P9  96.85,7.8 270 top
P10  91,7.8 270 top
P11  85.15,7.8 270 top
P12  79.3,7.8 270 top
P13  73.45,7.8 270 top
P14  67.6,7.8 270 top
P15  61.75,7.8 270 top
P16  55.9,7.8 270 top
P17  50.05,7.8 270 top
P18  44.2,7.8 270 top
P19  38.35,7.8 270 top
P20  32.5,7.8 270 top
P21  7.8,16.25 180 top
P22  7.8,22.1 180 top
P23  7.8,27.95 180 top
P24  7.8,33.8 180 top
P25  7.8,39.65 180 top
P26  7.8,45.5 180 top
P27  7.8,51.35 180 top
P28  7.8,57.2 180 top
P29  7.8,63.05 180 top
P30  7.8,68.9 180 top
P31  7.8,74.75 180 top
P32  7.8,80.6 180 top
P33  71.5,96.85 90 top
P34  77.35,96.85 90 top
P35  83.2,96.85 90 top
P36  89.7,96.85 90 top
P37  95.55,96.85 90 top
P38  101.4,96.85 90 top
P39  107.25,96.85 90 top
P40  113.1,96.85 90 top
P41  118.95,96.85 90 top
P42  124.8,96.85 90 top
P43  130.65,96.85 90 top
P44  136.5,96.85 90 top
P45  142.35,96.85 90 top
P46  148.2,96.85 90 top
P47  169.65,91.65 0 top
P48  169.65,85.8 0 top
R1  87.75,46.8 180 top
R2  82.55,50.7 90 top
R3  47.45,46.8 180 top
R4  42.25,50.7 90 top
R5  47.45,42.9 180 top
R6  87.75,42.9 180 top
R7  159.9,11.7 270 top
R8  165.1,11.7 270 top
R9  170.3,11.7 270 top
R10  128.05,46.8 180 top
R11  122.85,50.7 90 top
R12  128.05,42.9 180 top
S1  87.75,33.15 270 top
S2  47.45,33.15 270 top
S3  160.55,25.35 0 top
S4  128.05,33.15 270 top
SV1  34,91.65 180 top
X1  170.15,50.05 270 top

### Tracks (layer width: path | path; a pad name or v marks a point on that pad's centre or on a via)
12V
  Top 0.406: IC2.2 79.97,12.06 80.67,11.36 80.67,6.17 P12.1 | IC5.2 39.66,6.12 P19.1 | R9.1 176.8,19.15 176.8,60.9 174.95,62.75 169.4,62.75 X1.10 | IC9.2 120.27,12.54 121.49,11.31 121.49,9.41 P4.1
  Bottom 1.27: P32.1 P31.1 P30.1 P29.1 P28.1 P27.1 P26.1 P25.1 P24.1 P23.1 P22.1 P21.1 4.8,10.5 10.5,4.8 P20.1 P19.1 P18.1 P17.1 P16.1 P15.1 P14.1 P13.1 P12.1 P11.1 P10.1 P9.1 P8.1 P7.1 P6.1 P5.1 P4.1 P3.1 P2.1 P1.1 146.03,4.8 154.9,13.66 154.9,52.2 167.4,64.7 X1.10 169.6,66.95 176.15,66.95 176.15,82.3 P48.1 P47.1 172.65,93.6 169.4,96.85 153.69,96.85 150.69,99.85 P46.1 P45.1 P44.1 P43.1 P42.1 P41.1 P40.1 P39.1 P38.1 P37.1 P36.1 P35.1 P34.1 P33.1
!RESET1
  Top 0.406: IC1.36 84.17,53.62 85.5,52.29 85.5,42.9 | 85.5,42.9 R6.2 | 85.5,42.9 85.5,40.91 S1.1
!RESET2
  Top 0.406: IC3.36 43.87,53.72 45.15,52.44 45.15,42.9 | S2.1 45.15,40.96 45.15,42.9 | R5.2 45.15,42.9
!RESET3
  Top 0.406: S4.1 125.8,40.91 125.8,42.9 | IC6.36 124.5,54.64 124.5,53.76 125.8,52.45 125.8,42.9 | R12.2 125.8,42.9
ADC1_1  (via drill 0.35)
  Top 0.406: IC1.28 78.97,52.98 v78.65,52.65
  Bottom 0.406: v78.65,52.65 90.29,41.01 96.69,41.01 123.97,13.74 137.49,13.74 140.42,10.8 P1.4
ADC1_2  (via drill 0.35)
  Top 0.406: IC1.26 77.67,52.98 v77.35,52.65
  Bottom 0.406: v77.35,52.65 89.62,40.38 96.3,40.38 123.62,13.05 132.07,13.05 134.32,10.8 P2.4
ADC1_3  (via drill 0.35)
  Top 0.406: IC1.24 76.38,52.98 v76.05,52.65
  Bottom 0.406: v76.05,52.65 88.96,39.74 95.96,39.74 123.28,12.42 127.36,12.42 128.97,10.8 P3.4
ADC1_4  (via drill 0.35)
  Top 0.406: IC1.22 75.08,52.98 v74.75,52.65
  Bottom 0.406: v74.75,52.65 88.29,39.11 95.62,39.11 122.92,11.8 125.1,11.8 P4.4
ADC1_5  (via drill 0.35)
  Top 0.406: IC1.19 71.82,56.88 71.49,56.55 v70.85,56.55
  Bottom 0.406: P5.4 116.6,10.8 93.8,33.6 90.19,33.6 88.47,35.32 88.47,37.86 73.99,52.34 73.99,53.41 v70.85,56.55
ADC1_6  (via drill 0.35)
  Top 0.406: IC1.17 71.97,58.18 71.64,57.85 v70.85,57.85
  Bottom 0.406: P6.4 92.34,32.86 89.89,32.86 87.78,34.97 87.78,37.47 70.09,55.16 70.09,56.86 70.85,57.62 v70.85,57.85
ADC1_7  (via drill 0.35)
  Top 0.406: IC1.14 71.82,60.13 70.85,59.16 v70.85,59.15
  Bottom 0.406: P7.4 108.55,13 108.55,13.28 108.55,15.36 91.65,32.26 89.64,32.26 87.22,34.68 87.15,34.68 87.15,37.17 69.46,54.87 69.46,58.43 70.18,59.15 v70.85,59.15
ADC1_8  (via drill 0.35)
  Top 0.406: IC1.12 71.97,61.43 70.99,60.45 v70.85,60.45
  Bottom 0.406: P8.4 102.7,14.43 87.11,30.02 87.11,32.25 68.82,50.54 68.82,59.75 69.53,60.45 v70.85,60.45
ADC1_9  (via drill 0.35)
  Top 0.406: IC1.73 78.98,71.03 76.75,73.26 73.64,73.26 v71.5,75.4
  Bottom 0.406: v71.5,75.4 71.5,63.57 68.19,60.26 68.19,39.46 P9.4
ADC1_10  (via drill 0.35)
  Top 0.406: IC1.75 77.68,71.18 76.29,72.58 73.03,72.58 v70.2,75.4
  Bottom 0.406: v70.2,75.4 70.2,63.3 67.55,60.65 67.55,34.25 P10.4
ADC1_11  (via drill 0.35)
  Top 0.406: IC1.77 76.38,71.18 75.62,71.94 72.36,71.94 v68.9,75.4
  Bottom 0.406: v68.9,75.4 68.9,62.93 66.92,60.95 66.92,29.03 P11.4
ADC1_12  (via drill 0.35)
  Top 0.406: IC1.79 75.08,70.14 75.08,71.31 71.69,71.31 v67.6,75.4
  Bottom 0.406: v67.6,75.4 67.6,62.6 66.29,61.29 66.29,23.81 P12.4
ADC1_13  (via drill 0.35)
  Top 0.406: IC1.2 67.92,67.92 v66.3,69.55
  Bottom 0.406: P13.4 73.45,14.37 65.65,22.17 65.65,61.83 66.3,62.48 v66.3,69.55
ADC1_14  (via drill 0.35)
  Top 0.406: IC1.4 67.92,66.62 v65,69.55
  Bottom 0.406: P14.4 67.6,17.85 59.88,25.57 59.88,45.33 65,50.45 v65,69.55
ADC1_15  (via drill 0.35)
  Top 0.406: IC1.7 68.58,64.67 v63.7,69.55
  Bottom 0.406: v63.7,69.55 63.7,50.27 59.1,45.67 59.1,25.43 61.75,22.77 P15.4
ADC1_16  (via drill 0.35)
  Top 0.406: IC1.9 68.58,63.38 v62.4,69.55
  Bottom 0.406: v62.4,69.55 62.4,50.15 58.36,46.11 58.36,13.26 P16.4
ADC1_CS
  Top 0.406: IC1.63 85.47,79.83 78.85,86.45 51.9,86.45 SV1.9
ADC2_1  (via drill 0.35)
  Top 0.406: IC3.28 38.67,52.98 v38.35,52.65
  Bottom 0.406: P17.4 50.05,27.01 51.35,28.31 51.35,39.65 v38.35,52.65
ADC2_2  (via drill 0.35)
  Top 0.406: IC3.26 37.38,52.98 v37.05,52.65
  Bottom 0.406: P18.4 44.2,28.51 43.85,28.86 43.85,45.85 v37.05,52.65
ADC2_3  (via drill 0.35)
  Top 0.406: IC3.24 36.08,52.98 v35.75,52.65
  Bottom 0.406: v35.75,52.65 38.35,50.05 P19.4
ADC2_4  (via drill 0.35)
  Top 0.406: IC3.22 34.77,52.98 v34.45,52.65
  Bottom 0.406: v34.45,52.65 34.45,12.75 P20.4
ADC2_5  (via drill 0.35)
  Top 0.406: IC3.19 31.67,56.88 31.34,56.55 v30.55,56.55
  Bottom 0.406: P21.4 30.05,35.5 30.05,56.05 v30.55,56.55
ADC2_6  (via drill 0.35)
  Top 0.406: IC3.17 31.57,58.18 31.24,57.85 v30.55,57.85
  Bottom 0.406: v30.55,57.85 30.55,57.62 29.44,56.51 29.44,40.74 P22.4
ADC2_7  (via drill 0.35)
  Top 0.406: IC3.14 31.67,60.13 30.69,59.15 v30.55,59.15
  Bottom 0.406: P23.4 28.81,45.96 28.81,57.18 30.55,58.92 v30.55,59.15
ADC2_8  (via drill 0.35)
  Top 0.406: IC3.12 31.62,61.43 30.64,60.45 v30.55,60.45
  Bottom 0.406: P24.4 28.12,51.12 28.12,57.8 30.55,60.22 v30.55,60.45
ADC2_9  (via drill 0.35)
  Top 0.406: IC3.73 38.68,71.13 36.6,73.21 33.39,73.21 v31.2,75.4
  Bottom 0.406: P25.4 27.44,56.29 27.44,58.41 31.2,62.17 v31.2,75.4
ADC2_10  (via drill 0.35)
  Top 0.406: IC3.75 37.38,71.03 35.84,72.58 32.73,72.58 v29.9,75.4
  Bottom 0.406: v29.9,75.4 29.9,64.6 P26.4
ADC2_11  (via drill 0.35)
  Top 0.406: IC3.77 36.08,70.14 36.08,71.18 35.32,71.94 32.06,71.94 v28.6,75.4
  Bottom 0.406: v28.6,75.4 28.6,69.15 P27.4
ADC2_12  (via drill 0.35)
  Top 0.406: IC3.79 34.78,71.31 31.39,71.31 v27.3,75.4
  Bottom 0.406: v27.3,75.4 27.3,69.55 14.95,57.2 P28.4
ADC2_13  (via drill 0.35)
  Top 0.406: IC3.2 27.62,67.92 v26,69.55
  Bottom 0.406: v26,69.55 19.5,63.05 P29.4
ADC2_14  (via drill 0.35)
  Top 0.406: IC3.4 27.62,66.62 v24.7,69.55
  Bottom 0.406: P30.4 14.71,64.99 20.14,64.99 v24.7,69.55
ADC2_15  (via drill 0.35)
  Top 0.406: IC3.7 28.27,64.67 v23.4,69.55
  Bottom 0.406: v23.4,69.55 23.17,69.55 20.31,66.69 18.86,66.69 P31.4
ADC2_16  (via drill 0.35)
  Top 0.406: IC3.9 28.27,63.38 v22.1,69.55
  Bottom 0.406: v22.1,69.55 21.85,69.55 P32.4
ADC2_CS
  Top 0.406: IC3.63 45.18,73.64 41.49,77.34 41.49,94.79 41.6,94.9 45.99,94.9 SV1.10
ADC3_1  (via drill 0.35)
  Top 0.406: IC6.28 119.28,52.98 v118.95,52.65 | v107.25,52.65 98.8,61.1 98.8,79.95 91.69,87.06 78.29,87.06 P33.4
  Bottom 0.406: v118.95,52.65 116.98,50.68 109.22,50.68 v107.25,52.65
ADC3_2  (via drill 0.35)
  Top 0.406: IC6.26 117.97,52.98 v117.65,52.65 | v108.55,52.65 99.41,61.79 99.41,80.2 91.94,87.66 83.54,87.66 P34.4
  Bottom 0.406: v117.65,52.65 116.29,51.29 109.91,51.29 v108.55,52.65
ADC3_3  (via drill 0.35)
  Top 0.406: IC6.24 116.67,52.98 v116.35,52.65 | v109.85,52.65 100.01,62.49 100.01,80.45 92.2,88.27 88.78,88.27 P35.4
  Bottom 0.406: v116.35,52.65 116.11,52.65 115.36,51.9 110.84,51.9 110.08,52.65 v109.85,52.65
ADC3_4  (via drill 0.35)
  Top 0.406: IC6.22 115.38,52.98 v115.05,52.65 | v111.15,52.65 100.62,63.18 100.62,80.7 89.7,91.62 P36.4
  Bottom 0.406: v115.05,52.65 v111.15,52.65
ADC3_5
  Top 0.406: IC6.19 113.14,56.9 112.26,56.9 101.23,67.93 101.23,80.95 95.55,86.63 P37.4
ADC3_6
  Top 0.406: IC6.17 113.14,58.2 112.26,58.2 101.83,68.62 101.83,81.21 101.4,81.64 P38.4
ADC3_7
  Top 0.406: IC6.14 113.14,60.15 112.26,60.15 102.44,69.97 102.44,89.04 P39.4
ADC3_8
  Top 0.406: IC6.12 113.14,61.45 112.26,61.45 103.05,70.66 103.05,83.8 P40.4
ADC3_9  (via drill 0.35)
  Top 0.406: IC6.73 119.25,70.16 119.25,71.04 112.36,77.93 112.36,84.23 112.47,84.34 112.47,87.08 v110.5,89.05
  Bottom 0.406: P41.4 114.15,89.05 v110.5,89.05
ADC3_10  (via drill 0.35)
  Top 0.406: IC6.75 117.95,70.16 117.95,71.04 111.76,77.24 111.76,84.48 111.86,84.59 111.86,86.39 v110.5,87.75
  Bottom 0.406: P42.4 118.7,87.75 v110.5,87.75
ADC3_11  (via drill 0.35)
  Top 0.406: IC6.77 116.65,70.16 116.65,71.04 111.15,76.55 111.15,84.73 111.25,84.84 111.25,85.7 v110.5,86.45
  Bottom 0.406: P43.4 123.25,86.45 v110.5,86.45
ADC3_12  (via drill 0.35)
  Top 0.406: IC6.79 115.35,70.16 115.35,71.04 110.5,75.9 v110.5,85.15
  Bottom 0.406: P44.4 127.8,85.15 v110.5,85.15
ADC3_13  (via drill 0.35)
  Top 0.406: IC6.2 113.14,67.95 112.26,67.95 109.22,70.99 109.22,75.15 107.25,77.11 v107.25,77.35 | v141.7,77.35 142.35,78 P45.4
  Bottom 0.406: v141.7,77.35 v107.25,77.35
ADC3_14  (via drill 0.35)
  Top 0.406: IC6.4 113.14,66.65 112.26,66.65 108.61,70.3 108.61,74.46 107.25,75.81 v107.25,76.05 | P46.4 148.2,82.55 v141.7,76.05
  Bottom 0.406: v141.7,76.05 v107.25,76.05
ADC3_15  (via drill 0.35)
  Top 0.406: IC6.7 113.14,64.7 112.26,64.7 108,68.95 108,73.76 107.25,74.52 v107.25,74.75 | v141.7,74.75 158.6,91.65 P47.4
  Bottom 0.406: v141.7,74.75 v107.25,74.75
ADC3_16  (via drill 0.35)
  Top 0.406: IC6.9 113.14,63.4 112.26,63.4 107.25,68.4 v107.25,73.45 | v141.7,73.45 154.05,85.8 P48.4
  Bottom 0.406: v141.7,73.45 v107.25,73.45
ADC3_CS  (via drill 0.35)
  Top 0.406: IC6.63 125.78,78.33 v113.1,91 | v59.8,87.75 53.14,87.75 SV1.7
  Bottom 0.406: v113.1,91 72.39,91 69.14,87.75 v59.8,87.75
AVDD(5V)  (via drill 0.35)
  Top 0.305: 72.89,65.31 IC1.6
  Top 0.406: IC1.15 75.38,59.48 v75.4,59.5 75.4,57.19 73.72,55.51 73.72,12.38 P12.2 | IC1.30 80.28,57.17 v80.25,57.2 | v80.25,71.6 80.28,71.58 IC1.71 80.28,70.13 80.28,69.09 76.5,65.31 v75.4,65.31 72.89,65.31 | v39.95,71.6 39.98,71.55 39.98,70.16 IC3.71 39.98,70.13 39.98,69.19 36.11,65.33 34.73,65.33 | IC3.6 34.73,65.33 | 34.73,65.33 v34.75,65.35 | IC3.15 35.08,59.48 v35.1,59.5 35.1,57.19 33.37,55.46 33.37,52.66 33.77,52.26 33.77,8.07 P20.2 | IC3.30 39.98,57.17 v39.95,57.2 | R8.1 170.3,17.85 170.3,36.65 X1.4 | v120.55,71.5 120.58,71.47 IC6.71 120.55,70.12 120.55,69.23 116.64,65.33 115.67,65.33 | IC6.6 115.67,65.33 | 115.67,65.33 v115.7,65.35 | IC6.15 115.67,59.48 v115.7,59.5 115.7,57.17 114.1,55.57 114.1,12.35 P7.2 | IC6.30 120.58,57.17 v120.55,57.2
  Top 1.27: P1.2 144.98,6.8 152.75,14.56 152.75,27.95 164.35,39.55 X1.4
  Bottom 0.406: C9.1 75.4,66.85 v75.4,65.31 75.4,64.25 C30.1 75.4,63.85 75.4,61 | 75.4,61 v75.4,59.5 75.4,58.05 C31.1 76.28,56.77 78.42,56.77 C13.1 78.85,57.2 v80.25,57.2 81.8,57.2 C12.1 | 75.4,61 C11.1 | C10.1 78.75,71.6 v80.25,71.6 C24.1 | C35.1 38.45,71.6 v39.95,71.6 C33.1 | C34.1 34.75,66.7 v34.75,65.35 34.75,64.2 C36.1 34.9,61.2 C38.1 35.1,61 v35.1,59.5 35.1,58.05 C37.1 34.9,57.66 35.84,56.72 37.41,56.72 37.69,57 C40.1 38.55,57.2 v39.95,57.2 41.5,57.2 C39.1 | C59.1 122.1,71.5 v120.55,71.5 119.15,71.5 C60.1 | C58.1 115.7,66.85 v115.7,65.35 115.7,63.9 C57.1 115.6,63.6 C54.1 115.7,61 v115.7,59.5 115.7,58.05 C56.1 116.4,56.95 118.9,56.95 C55.1 119.15,57.2 v120.55,57.2 122.1,57.2 C53.1
  Bottom 1.27: P1.2 P2.2 P3.2 P4.2 P5.2 P6.2 P7.2 P8.2 P9.2 P10.2 P11.2 P12.2 P13.2 P14.2 P15.2 P16.2 P17.2 P18.2 P19.2 P20.2 11.7,6.8 6.8,11.7 P21.2 P22.2 P23.2 P24.2 P25.2 P26.2 P27.2 P28.2 P29.2 P30.2 P31.2 P32.2 6.8,85.39 1.85,90.34 1.85,92.95 3.69,94.8 6.3,94.8 8.19,92.92 SV1.40 SV1.38 17.34,97.85 P33.2 P34.2 P35.2 P36.2 P37.2 P38.2 P39.2 P40.2 P41.2 P42.2 P43.2 P44.2 P45.2 P46.2 149.44,97.85 158.89,88.4 170.65,88.4 | P47.2 170.65,88.4 | 170.65,88.4 P48.2 170.65,80.52 169.29,79.16 169.29,72.56 X1.23
CONVST  (via drill 0.35)
  Top 0.406: IC7.2 74.1,76.05 | 74.1,76.05 71.92,76.05 71.81,76.16 65,76.16 56.03,85.13 50.68,85.13 SV1.11 42.25,87.2 v42.25,78.65 | IC4.2 36.03,76.07 34.87,76.07 33.8,77.14 v33.8,78.65 | IC8.2 116.6,76.1 115.96,76.1 114.4,77.66 v114.4,78.65 | v74.1,78.65 74.1,76.05
  Bottom 0.406: v33.8,78.65 v42.25,78.65 | v114.4,78.65 v74.1,78.65
CONVST1
  Top 0.406: IC7.4 82.22,71.53 IC1.68
CONVST2
  Top 0.406: IC4.4 41.92,71.53 IC3.68
CONVST3
  Top 0.406: IC8.4 122.53,71.53 IC6.68
DVDD(3.3V)  (via drill 0.35)  (1 unrouted)
  Top 0.406: R6.1 R1.1 90.9,49.1 90.9,57.75 C2.1 90.9,57.95 90.9,59.45 | IC7.5 78.35,79.65 v78.65,79.95 | v97.5,79.95 97.5,62.21 94.74,59.45 90.9,59.45 | 90.9,59.45 C1.1 90.58,61.42 IC1.49 | IC3.49 50.27,61.42 C14.1 50.6,59.35 | 50.6,59.35 50.6,57.95 | 50.6,57.95 C15.1 | R5.1 R3.1 50.6,49.1 50.6,57.95 | IC4.5 38.05,79.65 v38.35,79.95 | v57.2,79.95 57.2,62.05 54.5,59.35 50.6,59.35 | X1.1 167.4,20.15 R7.1 | IC8.5 118.65,79.65 v118.95,79.95 | R12.1 R10.1 131.1,49 C42.1 131.1,59.35 | IC6.49 130.88,61.42 C41.1 131.1,61 131.1,59.35 | v137.8,79.95 137.8,61.85 135.3,59.35 131.1,59.35 | JP1.1 159.1,73.15 X1.12
  Bottom 0.406: v38.35,79.95 v57.2,79.95 v78.65,79.95 v97.5,79.95 v118.95,79.95 v137.8,79.95 160.6,79.95 X1.12
GND
  Top 0.254: IC1.21 74.52,54.76 74.52,55.53 74.72,55.73 75.44,55.73 75.63,55.53 75.63,54.76 IC1.23 | IC3.21 34.22,54.76 34.22,55.53 34.41,55.73 35.13,55.73 35.33,55.53 35.33,54.76 IC3.23 | IC6.18 113.26,57.43 114.03,57.43 114.23,57.23 114.23,56.52 114.03,56.32 113.26,56.32 IC6.20 | IC6.21 114.82,54.76 114.82,55.53 115.02,55.73 115.73,55.73 115.93,55.53 115.93,54.76 IC6.23
  pour Top: -0.65,105.3 -0.65,-0.65 180.7,-0.65 180.7,105.3
  pour Bottom: -1.3,105.95 -1.3,-1.3 181.35,-1.3 181.35,105.95
MISO  (via drill 0.35)
  Top 0.406: IC1.57 89.28,66.62 89.7,67.04 v89.7,82.55 | v35.25,82.55 35.25,90.36 SV1.19 | IC3.57 48.98,66.62 49.4,67.04 v49.4,82.55 | IC6.57 128.66,66.65 129.54,66.65 130,67.1 v130,82.55
  Bottom 0.406: v35.25,82.55 v49.4,82.55 v89.7,82.55 v130,82.55
MOSI  (via drill 0.35)
  Top 0.406: IC1.55 89.33,65.32 90.6,66.59 v90.6,83.85 | v32.7,83.85 32.7,90.35 SV1.21 | IC3.55 49.18,65.32 50.3,66.44 v50.3,83.85 | IC6.55 128.66,65.35 129.54,65.35 130.9,66.7 v130.9,83.85
  Bottom 0.406: v32.7,83.85 v50.3,83.85 v90.6,83.85 v130.9,83.85
N$1
  Top 0.406: R8.2 LED2.A
N$3
  Top 0.406: LED1.A R7.2
N$4
  Top 0.406: LED3.A R9.2
PSU_EN
  Bottom 0.406: S3.2 164.6,29.4 164.6,31.02 166.78,33.2 169.27,33.2 170.3,34.23 170.3,36.25 171.48,37.43 172.9,37.43 X1.16
REFCAP1
  Top 0.406: IC1.31 80.92,52.73 C27.1
REFCAP2
  Top 0.406: IC3.31 40.62,52.42 C23.1
REFCAP3
  Top 0.406: IC6.31 121.22,52.73 C50.1
REFINOUT1
  Top 0.406: IC1.33 82.22,51.88 R2.2 83.85,50.25 C5.1
REFINOUT2
  Top 0.406: IC3.33 41.92,51.88 R4.2 43.55,50.25 C18.1
REFINOUT3
  Top 0.406: IC6.33 122.53,51.88 R11.2 124.15,50.25 C45.1
REGCAP1  (via drill 0.35)
  Top 0.406: IC1.70 80.92,67.92 v79.95,66.95
  Bottom 0.406: 81.25,66.97 79.97,66.97 v79.95,66.95 | C29.1 84.28,66.97 81.25,66.97 | C28.1 81.25,66.97
REGCAP2  (via drill 0.35)
  Top 0.406: IC3.70 40.62,67.92 v39.65,66.95
  Bottom 0.406: v39.65,66.95 40.95,66.95 | 40.95,66.95 C26.1 | C25.1 40.95,66.95
REGCAP3  (via drill 0.35)
  Top 0.406: IC6.70 121.22,67.92 v120.25,66.95
  Bottom 0.406: v120.25,66.95 121.55,66.95 | 121.55,66.95 C52.1 | C51.1 121.55,66.95
REGCAPD1
  Top 0.406: IC1.52 91.12,63.38 C4.1 91.45,64.35 92.2,65.1 C3.1
REGCAPD2
  Top 0.406: C16.1 51.9,65.6 50.5,64.35 C17.1 50.33,63.38 IC3.52
REGCAPD3
  Top 0.406: IC6.52 131.43,63.38 C44.1 131.75,64.35 132.5,65.1 C43.1
SCL
  Top 0.406: SV1.35 16.25,91.68 16.25,96.85 21.45,102.05 137.8,102.05 138.63,101.22 138.63,57.02 141.05,54.6 150.71,54.6 JP1.5
SCLK  (via drill 0.35)
  Top 0.406: IC1.62 v86.12,81.2 | v37.8,81.2 SV1.17 | v45.82,81.2 45.82,70.16 IC3.62 | v126.42,81.25 IC6.62
  Bottom 0.406: v37.8,81.2 v45.82,81.2 v86.12,81.2 86.17,81.25 v126.42,81.25
SDA
  Top 0.406: SV1.37 13.65,91.62 13.65,96.85 20.15,103.35 137.8,103.35 139.25,101.9 139.25,57.3 141.3,55.25 148.85,55.25 152.07,58.47 JP1.4
SER/!PAR1
  Top 0.406: IC1.40 86.78,46.92 R1.2
SER/!PAR2
  Top 0.406: IC3.40 46.48,46.92 R3.2
SER/!PAR3
  Top 0.406: IC6.40 127.08,46.92 R10.2
VREF1(2.5V)
  Top 0.406: IC2.6 81.25,35.88 81.25,40.95 | 81.25,43.55 81.25,40.95 | 81.25,43.55 C32.1 | 81.25,40.95 C7.1 | 81.25,40.95 C8.1 | 81.25,43.55 C6.1 82.55,43.6 R2.1
VREF2(2.5V)
  Top 0.406: C21.1 40.95,43.55 | 40.95,43.55 C19.1 R4.1 | C20.1 40.95,40.95 | C22.1 40.95,40.95 | IC5.6 40.95,35.88 40.95,40.95 | 40.95,40.95 40.95,43.55
VREF3(2.5V)
  Top 0.406: C49.1 121.55,43.55 | 121.55,43.55 C46.1 122.85,43.75 R11.1 | C47.1 121.55,40.95 | 121.55,40.95 C48.1 | IC9.6 121.53,40.94 | 121.53,40.94 121.55,40.95 | 121.53,40.94 121.53,43.53 121.55,43.55

### Text on the board
tNames: 48-Channel ADC Control Board v1.0 | ADC2 | 12V | Designed by Gao Linkun | 5V | GND | SIG | GND | 5V | 12V | SIG | MOSI | MISO | SCLK | CONVST | ADC1_CS | ADC3_CS | On | Off | SIG | 12V | 5V | GND | SIG | GND | 5V | 3.3V | 5V | 12V | 12V